# EAGLE design pm_externa (EAGLE 4.11)
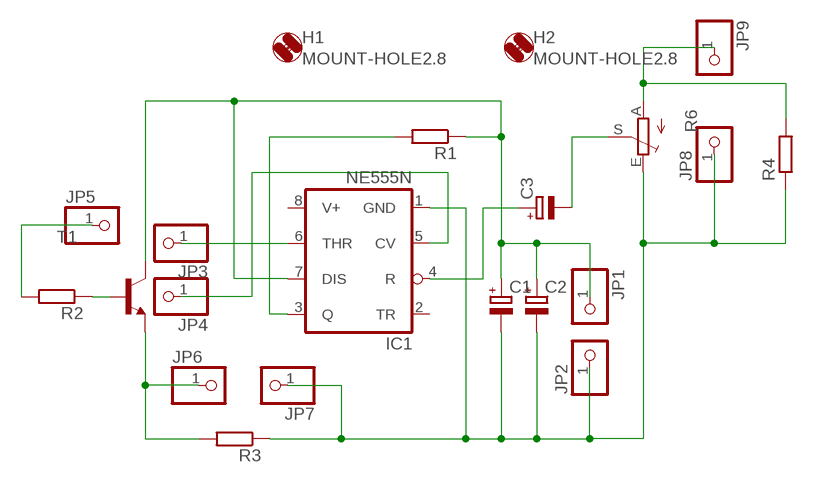
[diagram p0: schematic, sheet 1]

## Parts
C1  CPOL-EUB45181A  [B45181A]
C2  CPOL-EUB45181A  [B45181A]
C3  CPOL-EUB45181A  [B45181A]
H1  MOUNT-HOLE2.8  [2,8]
H2  MOUNT-HOLE2.8  [2,8]
IC1  NE555N  [DIL08]
JP1  PINHD-1X1  [1X01]
JP2  PINHD-1X1  [1X01]
JP3  PINHD-1X1  [1X01]
JP4  PINHD-1X1  [1X01]
JP5  PINHD-1X1  [1X01]
JP6  PINHD-1X1  [1X01]
JP7  PINHD-1X1  [1X01]
JP8  PINHD-1X1  [1X01]
JP9  PINHD-1X1  [1X01]
R1  R-EU_0207/10  [0207/10]
R2  R-EU_0207/10  [0207/10]
R3  R-EU_0207/10  [0207/10]
R4  R-EU_0207/10  [0207/10]
R6  TRIM_EU-B25P  [B25P]
T1  BC549B-NPN-TO92-EBC  [TO92-EBC]

## Nets
N$1: C1.+ C2.+ IC1.7(DIS) JP1.1 R1.1 T1.C
N$2: IC1.3(Q) R1.2
N$3: C1.- C2.- IC1.1(GND) JP2.1 JP7.1 JP8.1 R3.1 R4.1 R6.E
N$4: IC1.6(THR) JP3.1
N$5: IC1.5(CV) JP4.1
N$6: JP5.1 R2.2
N$7: R2.1 T1.B
N$8: JP6.1 R3.2 T1.E
N$9: JP9.1 R4.2 R6.A
N$10: C3.+ IC1.4(R)
N$13: C3.- R6.S
Unconnected: IC1.2(TR)

## Power pins joined to a net without a drawn wire
V+: IC1.8(V+)

## Library data of the parts
C1-C3 = rcl:CPOL-EU: POLARIZED CAPACITOR, European symbol
H1 H2 = holes:MOUNT-HOLE: MOUNTING HOLE with drill center marker
IC1 = linear:*555: TIMER
JP1-JP9 = pinhead:PINHD-1X1: PIN HEADER
R1-R4 = rcl:R-EU_: RESISTOR, European symbol
R6 = pot:TRIM_EU-: POTENTIOMETER
T1 = transistor:*-NPN-: NPN Transistror

## Board
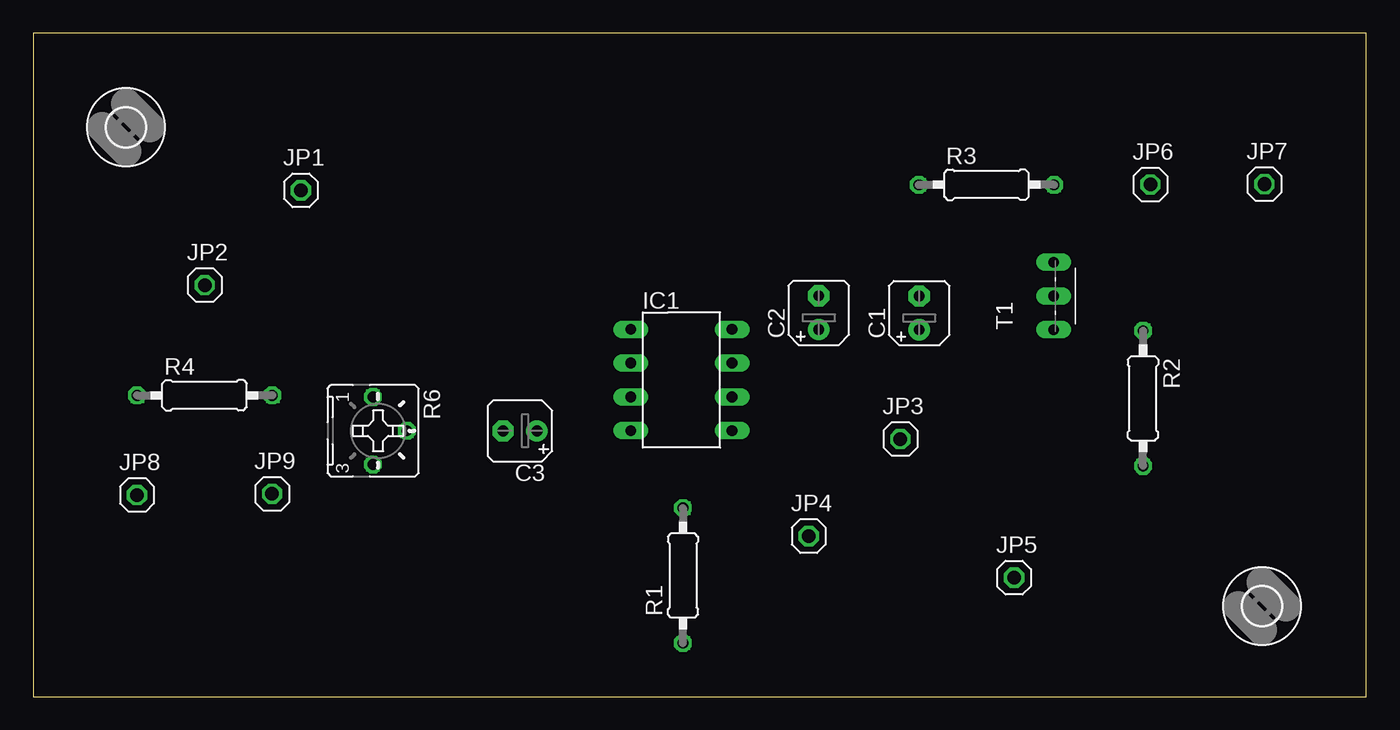
[diagram p1: board, top side]
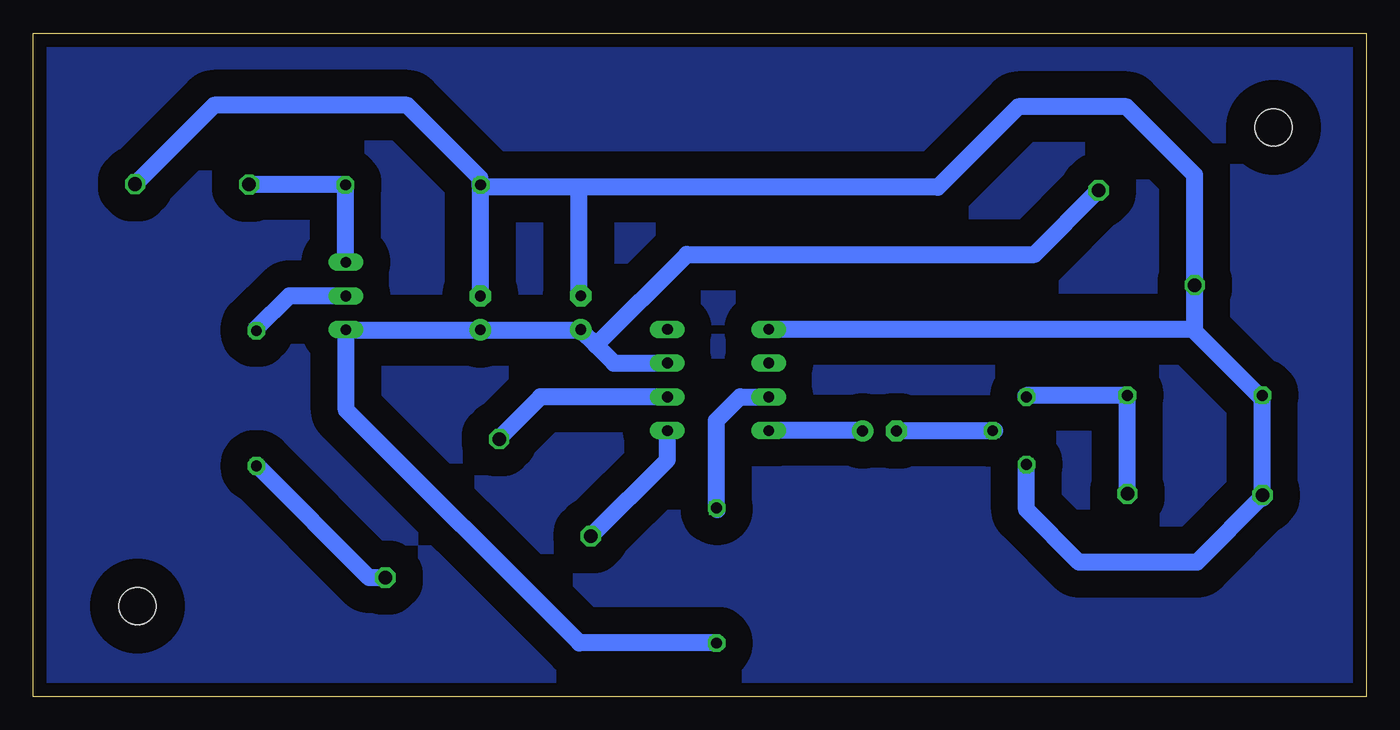
[diagram p2: board, bottom side, seen from below]

Size 100.24 x 49.91 mm. Coordinates in mm from the lower left corner, seen from the top.
Outline: 0,0 100.24,0 100.24,49.91 0,49.91 0,0
Copper layers 16: Bottom 0.035mm
Design rules "default": minimum track width 10mil, minimum drill 24mil, track to track 80mil, track to pad 80mil, pad to pad 80mil, via to via 80mil, smd to smd 80mil, copper to edge 40mil, drill to drill 8mil, minimum pad ring 10mil, minimum via ring 8mil, stop-mask expansion 4mil, vias tented up to drill 0mil, thermal gap 10mil

### Footprints (pad centres in the part's own frame; a part is rotated, then mirrored left to right if it is on the bottom)
B45181A = drill 0.813 pad 1.6 round: + -1.27,0 | drill 0.813 pad 1.6 octagon: - 1.27,0
2,8 = hole 2.8: 0,0
DIL08 = drill 0.813 long: 1 -3.81,-3.81; 2 -1.27,-3.81; 3 1.27,-3.81; 4 3.81,-3.81; 5 3.81,3.81; 6 1.27,3.81; 7 -1.27,3.81; 8 -3.81,3.81
1X01 = drill 1.016 octagon: 1 0,0
0207/10 = drill 0.813 octagon: 1 -5.08,0; 2 5.08,0
B25P = drill 0.813 octagon: A -2.54,0; E 2.54,0; S 0,2.54
TO92-EBC = drill 0.813 long: B 0,-1.27; C -2.54,-1.27; E 2.54,-1.27

### Placement (x,y rotation side)
C1  66.62,28.87 90 top
C2  59.07,28.88 90 top
C3  36.61,19.99 180 top
H1  6.97,42.83 0 top
H2  92.39,6.82 0 top
IC1  48.74,23.82 270 top
JP1  20.13,38.09 0 top
JP2  12.89,30.96 0 top
JP3  65.2,19.38 0 top
JP4  58.32,12.09 0 top
JP5  73.75,8.96 0 top
JP6  84,38.53 0 top
JP7  92.58,38.56 0 top
JP8  7.8,15.17 0 top
JP9  17.96,15.26 0 top
R1  48.86,9.12 90 top
R2  83.45,22.44 270 top
R3  71.68,38.51 0 top
R4  12.89,22.67 0 top
R6  25.55,20.01 270 top
T1  75.45,30.14 90 top

### Tracks (layer width: path | path; a pad name or v marks a point on that pad's centre or on a via)
N$1
  Bottom 1.27: IC1.7 56.58,25.09 57.93,26.44 | 57.93,26.44 59.07,27.58 C2.+ 59.1,27.61 59.18,27.7 59.28,27.6 C1.+ 76.87,27.6 76.88,27.6 | 76.88,27.6 76.91,27.64 | 76.88,27.6 T1.C 76.72,27.45 76.69,27.42 76.69,21.56 59.17,4.04 R1.1 | JP1.1 24.95,33.28 51.09,33.28 57.93,26.44 | 57.93,26.44
N$2
  Bottom 1.27: IC1.3 47.09,22.55 48.87,20.78 48.87,14.14 48.86,14.13 | 48.86,14.13 48.81,14.08 | R1.2 48.86,14.13
N$3
  Bottom 1.27: 7.8,14.94 7.8,15.09 | JP8.1 7.8,15.09 | 7.8,14.94 R4.1 8.1,22.67 13.12,27.7 13.12,27.63 | 7.8,14.94 7.82,14.92 | 13.12,27.63 13,27.63 12.95,27.59 12.89,27.59 JP2.1 12.89,31.04 12.9,31.04 12.9,39.25 18.03,44.38 26.17,44.38 32.22,38.33 59.24,38.33 | 13.12,27.63 IC1.1 | R6.E 25.55,14.07 21.6,10.12 12.73,10.12 7.77,15.09 7.8,15.09 | C2.- 59.07,30.21 59.13,30.26 59.25,30.14 59.25,38.23 59.24,38.24 59.24,38.33 | JP7.1 86.65,44.49 72.12,44.49 66.66,39.03 66.66,38.46 66.64,38.46 R3.1 66.6,38.36 66.62,38.33 66.49,38.33 | 59.24,38.33 66.49,38.33 | 66.49,38.33 66.49,38.41 66.62,38.27 C1.-
N$4
  Bottom 1.27: 65.26,19.38 | 65.26,19.38 JP3.1 | IC1.6 62.09,22.55 65.26,19.38
N$5
  Bottom 1.27: 58.32,12.05 58.4,11.96 | JP4.1 58.32,12.05 | IC1.5 52.55,17.82 58.32,12.05
N$6
  Bottom 1.27: R2.2 83.37,17.36 74.97,8.96 JP5.1
N$7
  Bottom 1.27: R2.1 83.45,27.6 83.5,27.64 80.99,30.14 T1.B
N$8
  Bottom 1.27: T1.E 76.77,32.68 76.8,32.72 76.76,32.77 R3.2 76.85,38.51 76.86,38.53 JP6.1
N$9
  Bottom 1.27: 25.61,22.62 R6.A 25.55,22.57 25.45,22.67 R4.2 17.96,15.19 | 17.96,15.19 17.92,15.14 | JP9.1 17.96,15.19
N$10
  Bottom 1.27: 37.82,20.01 37.82,19.99 C3.+ | 37.82,20.01 IC1.4 | 37.82,20.01 37.82,20.05
N$11
  pour Bottom: 0.74,1.34 99.12,1.34 99.12,48.9 0.79,48.9 0.79,1.23 0.9,1.23 0.9,1.34
N$12  (via drill 0.61)
  other vias: 44.92,27.69
N$13
  Bottom 1.27: R6.S 27.95,20 27.95,19.99 C3.-
N$14  (via drill 0.61)
  other vias: 52.6,27.64
N$15  (via drill 0.61)
  other vias: 52.6,25.13
N$16  (via drill 0.61)
  other vias: 52.6,22.58
N$17  (via drill 0.61)
  other vias: 52.6,20.02
N$18  (via drill 0.61)
  other vias: 44.92,20.02
N$19  (via drill 0.61)
  other vias: 44.98,22.58
N$20  (via drill 0.61)
  other vias: 44.98,25.13
N$21  (via drill 0.61)
  other vias: 37.88,20.01
N$22  (via drill 0.61)
  other vias: 59.1,27.6
N$23  (via drill 0.61)
  other vias: 59.15,30.16
N$24  (via drill 0.61)
  other vias: 12.9,30.94
N$25  (via drill 0.61)
  other vias: 7.84,22.62
N$26  (via drill 0.61)
  other vias: 18.02,22.62
N$27  (via drill 0.61)
  other vias: 25.55,22.59
N$28  (via drill 0.61)
  other vias: 28.11,19.98
N$29  (via drill 0.61)
  other vias: 25.55,17.45
N$30  (via drill 0.61)
  other vias: 20.19,38.07
N$31  (via drill 0.61)
  other vias: 66.64,30.16
N$32  (via drill 0.61)
  other vias: 66.61,38.51
N$33  (via drill 0.61)
  other vias: 76.78,38.48
N$34  (via drill 0.61)
  other vias: 76.73,32.69
N$35  (via drill 0.61)
  other vias: 76.73,30.13
N$36  (via drill 0.61)
  other vias: 66.64,27.6
N$37  (via drill 0.61)
  other vias: 76.78,27.6
N$38  (via drill 0.61)
  other vias: 65.17,19.41
N$39  (via drill 0.61)
  other vias: 58.31,12.12
N$40  (via drill 0.61)
  other vias: 73.71,8.96
N$41  (via drill 0.61)
  other vias: 83.45,17.37
N$42  (via drill 0.61)
  other vias: 83.5,27.57
N$43  (via drill 0.61)
  other vias: 83.99,38.54
N$44  (via drill 0.61)
  other vias: 92.59,38.56
N$45  (via drill 0.61)
  other vias: 17.96,15.3
N$46  (via drill 0.61)
  other vias: 7.81,15.14
N$47  (via drill 0.61)
  other vias: 35.35,20.03
N$48  (via drill 0.61)
  other vias: 48.9,14.17
N$49  (via drill 0.61)
  other vias: 48.87,4.02